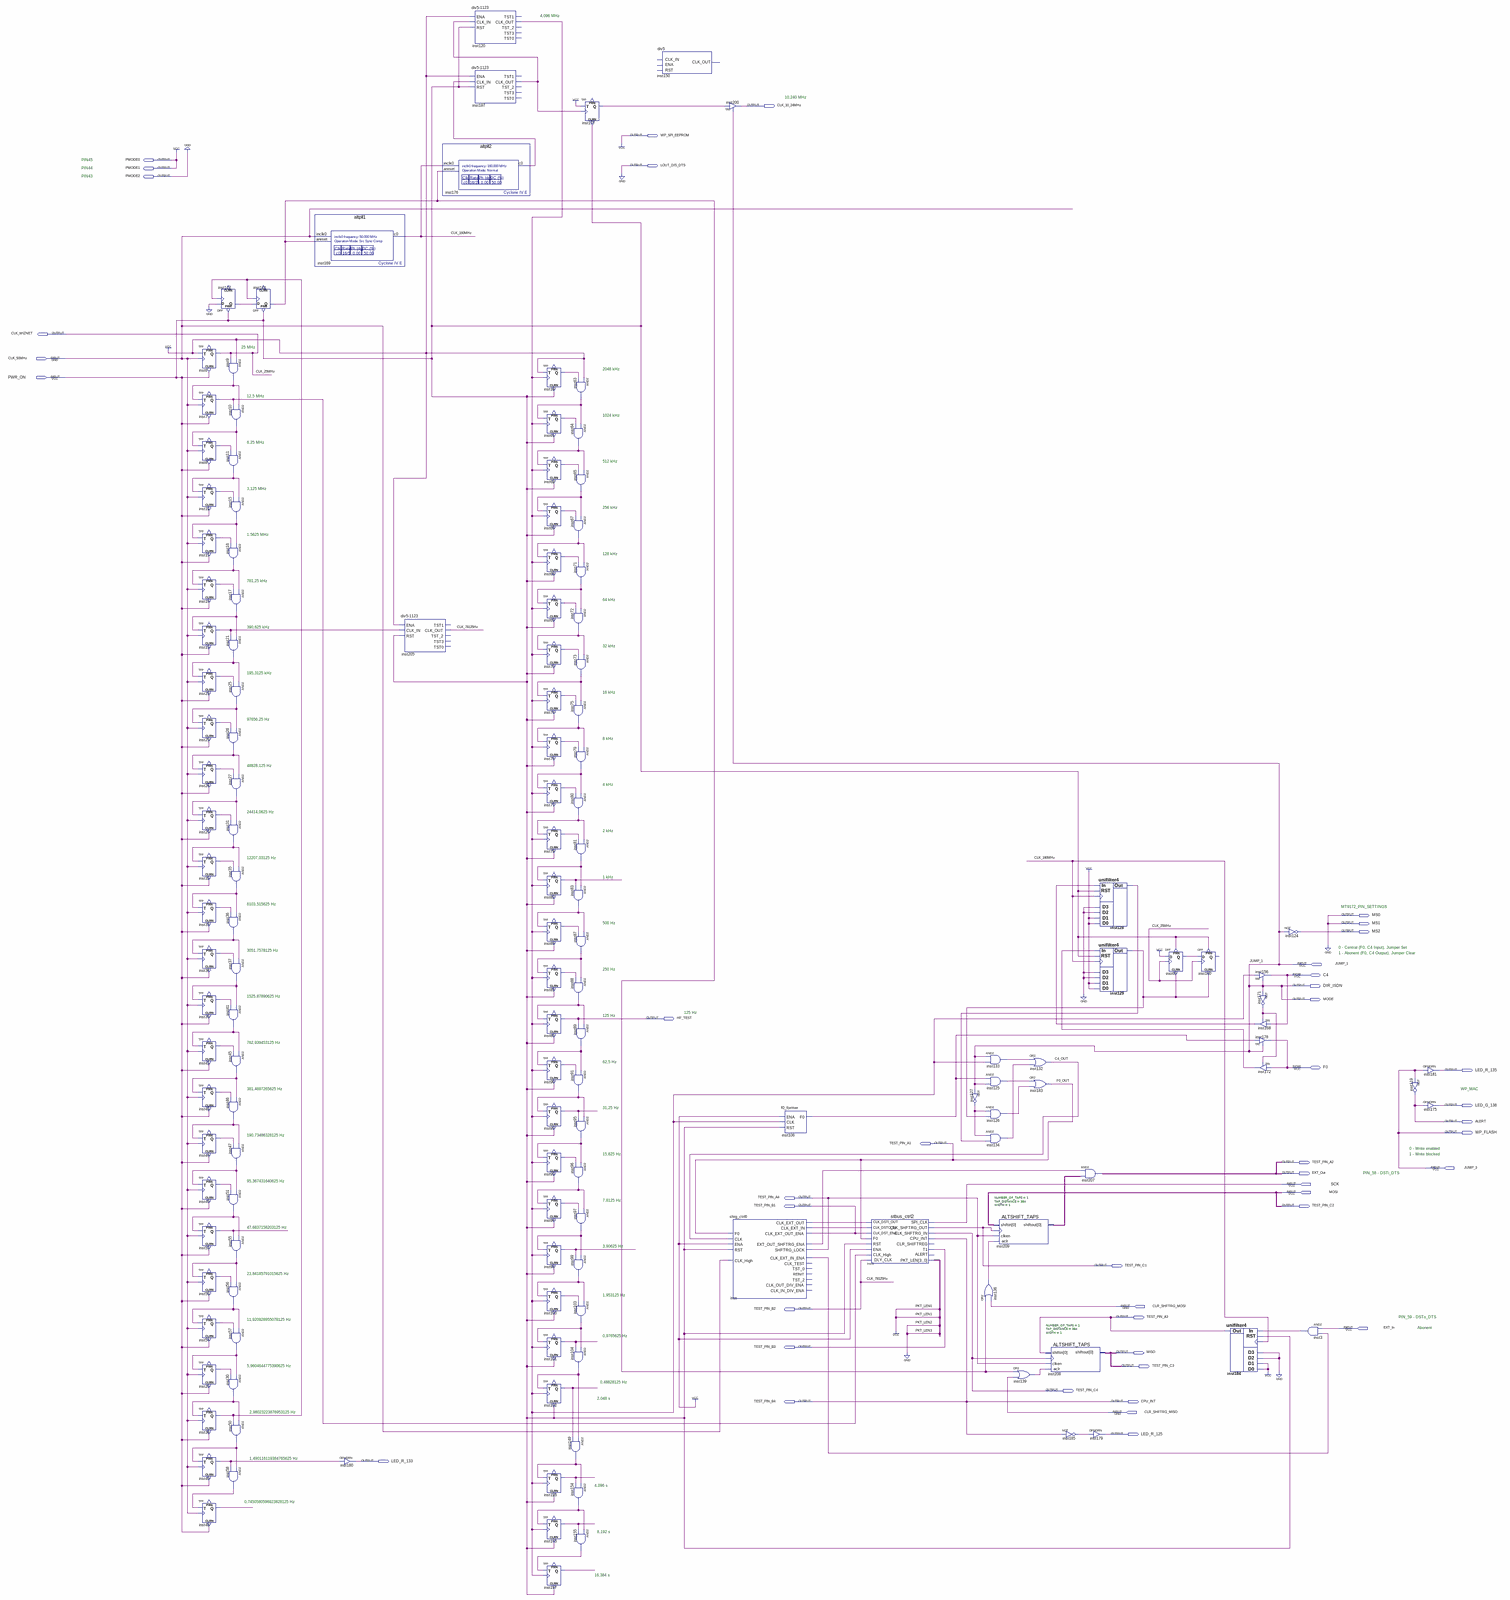
[diagram p0: schematic sheet, whole]
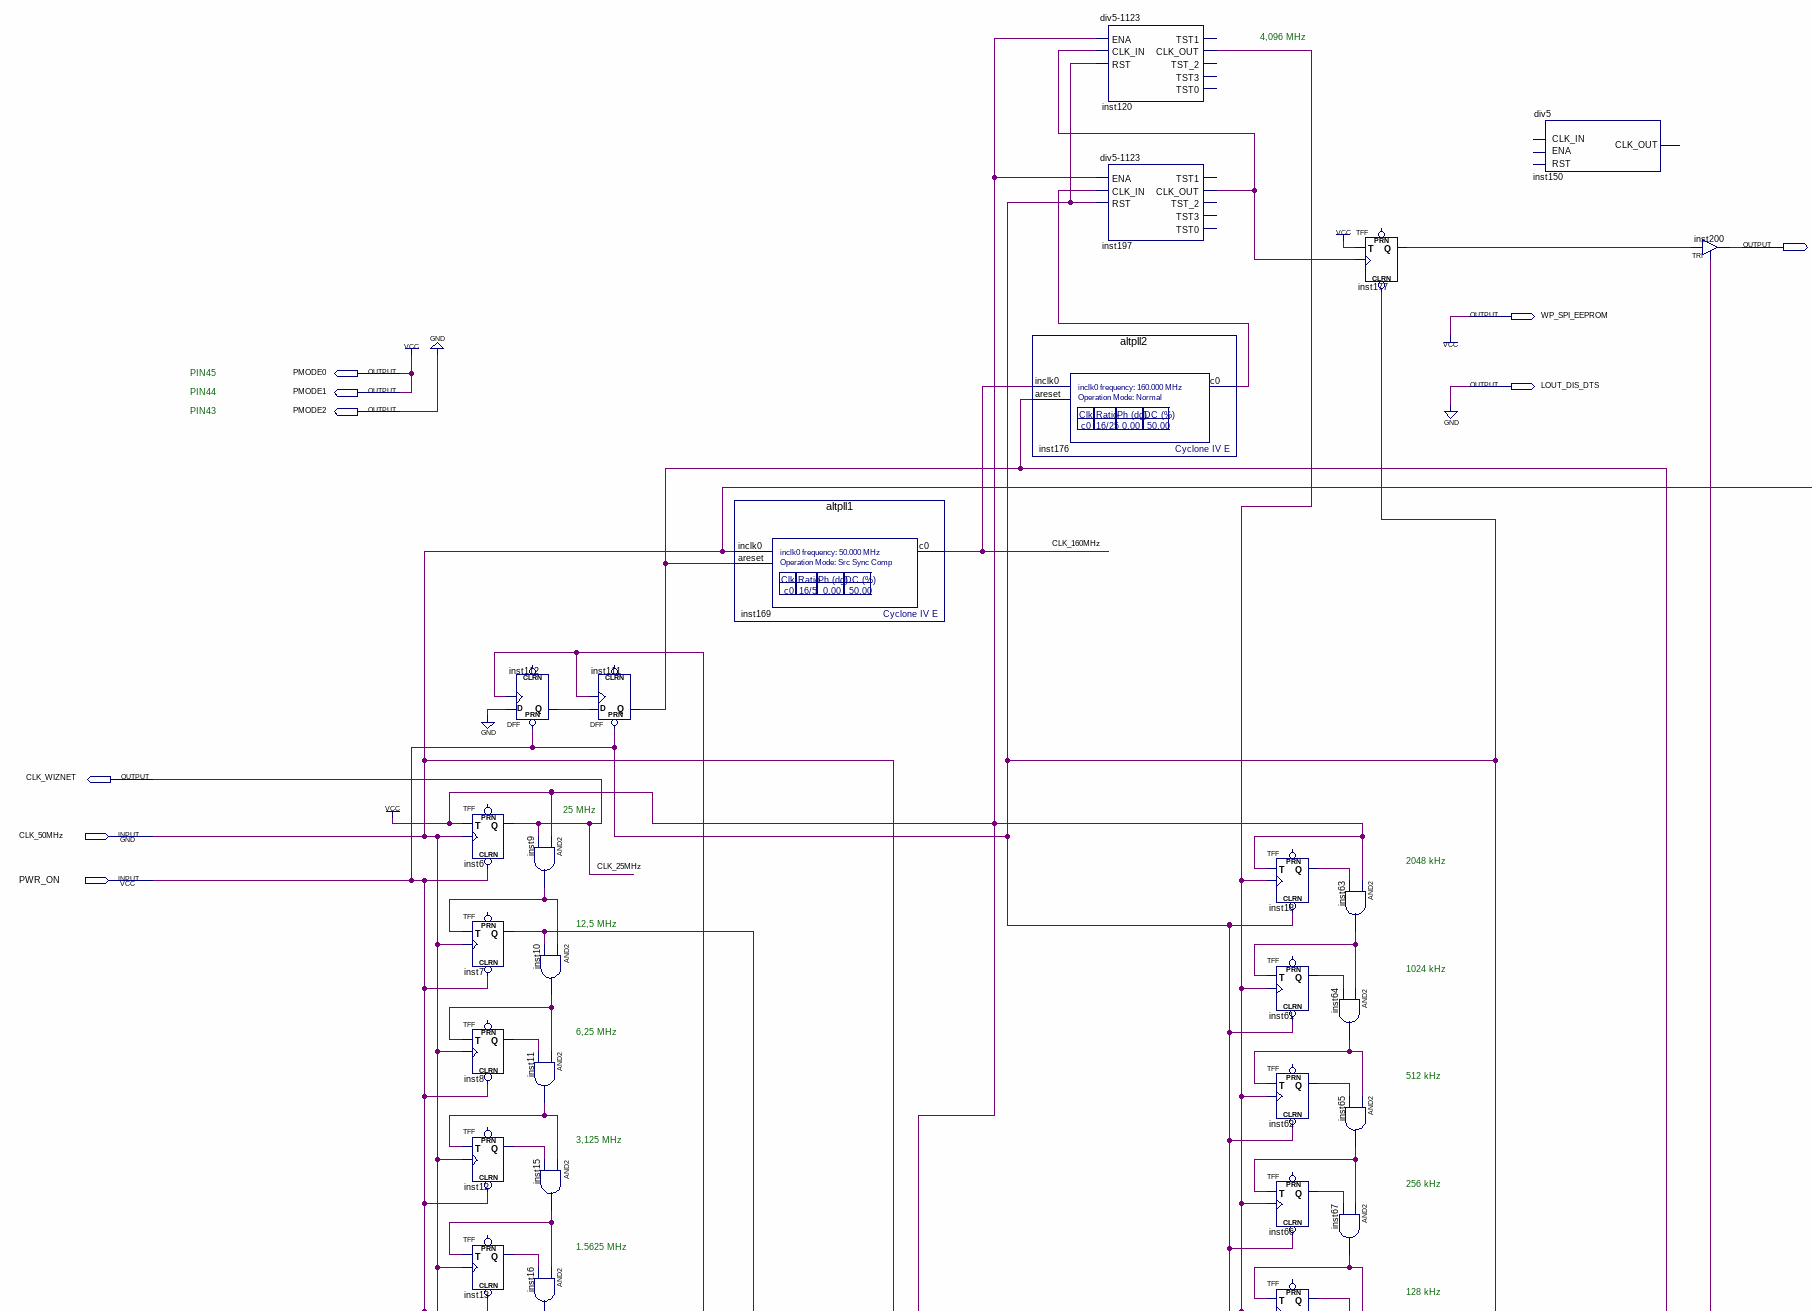
[diagram p1: schematic sheet, upper left part]
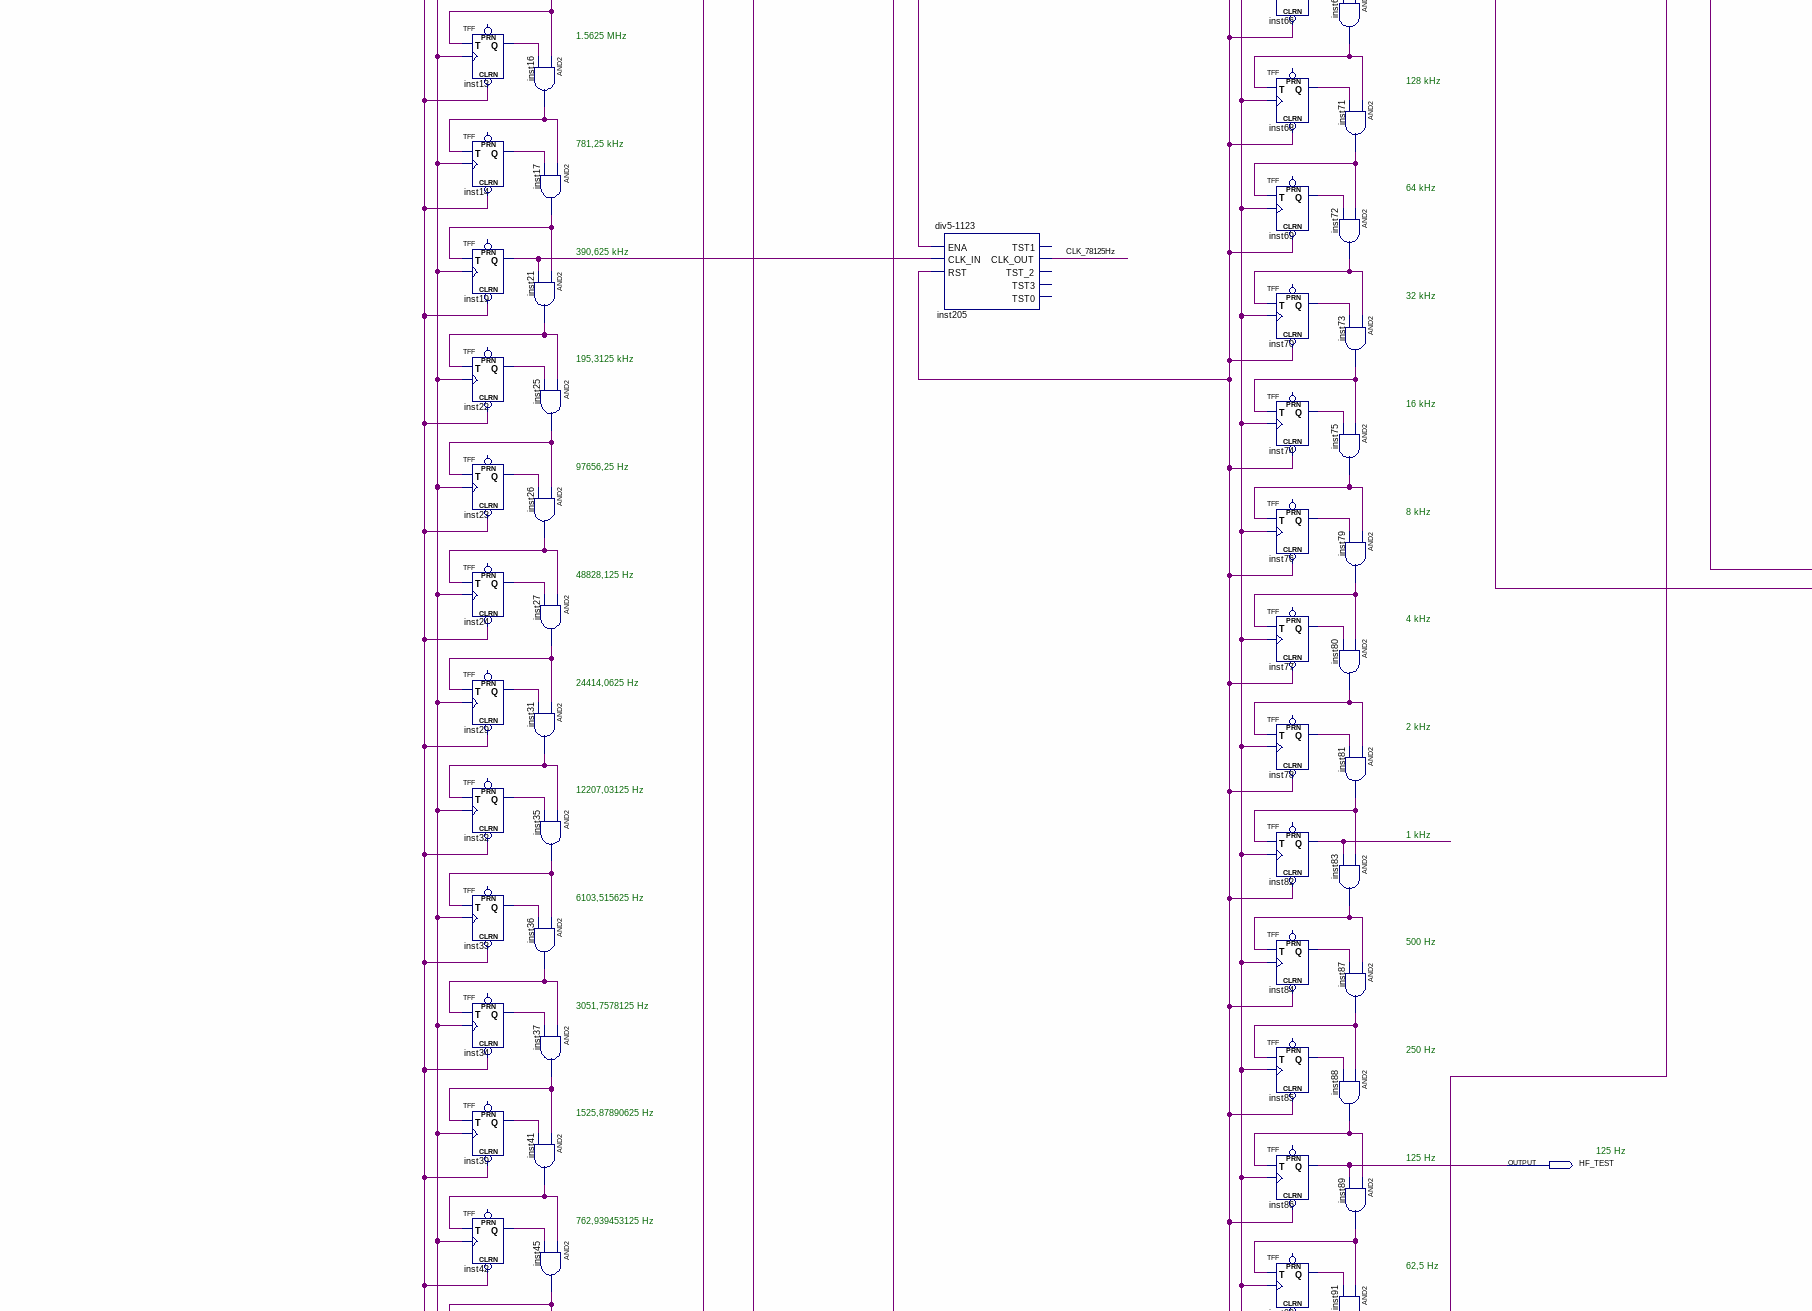
[diagram p2: schematic sheet, middle left part]
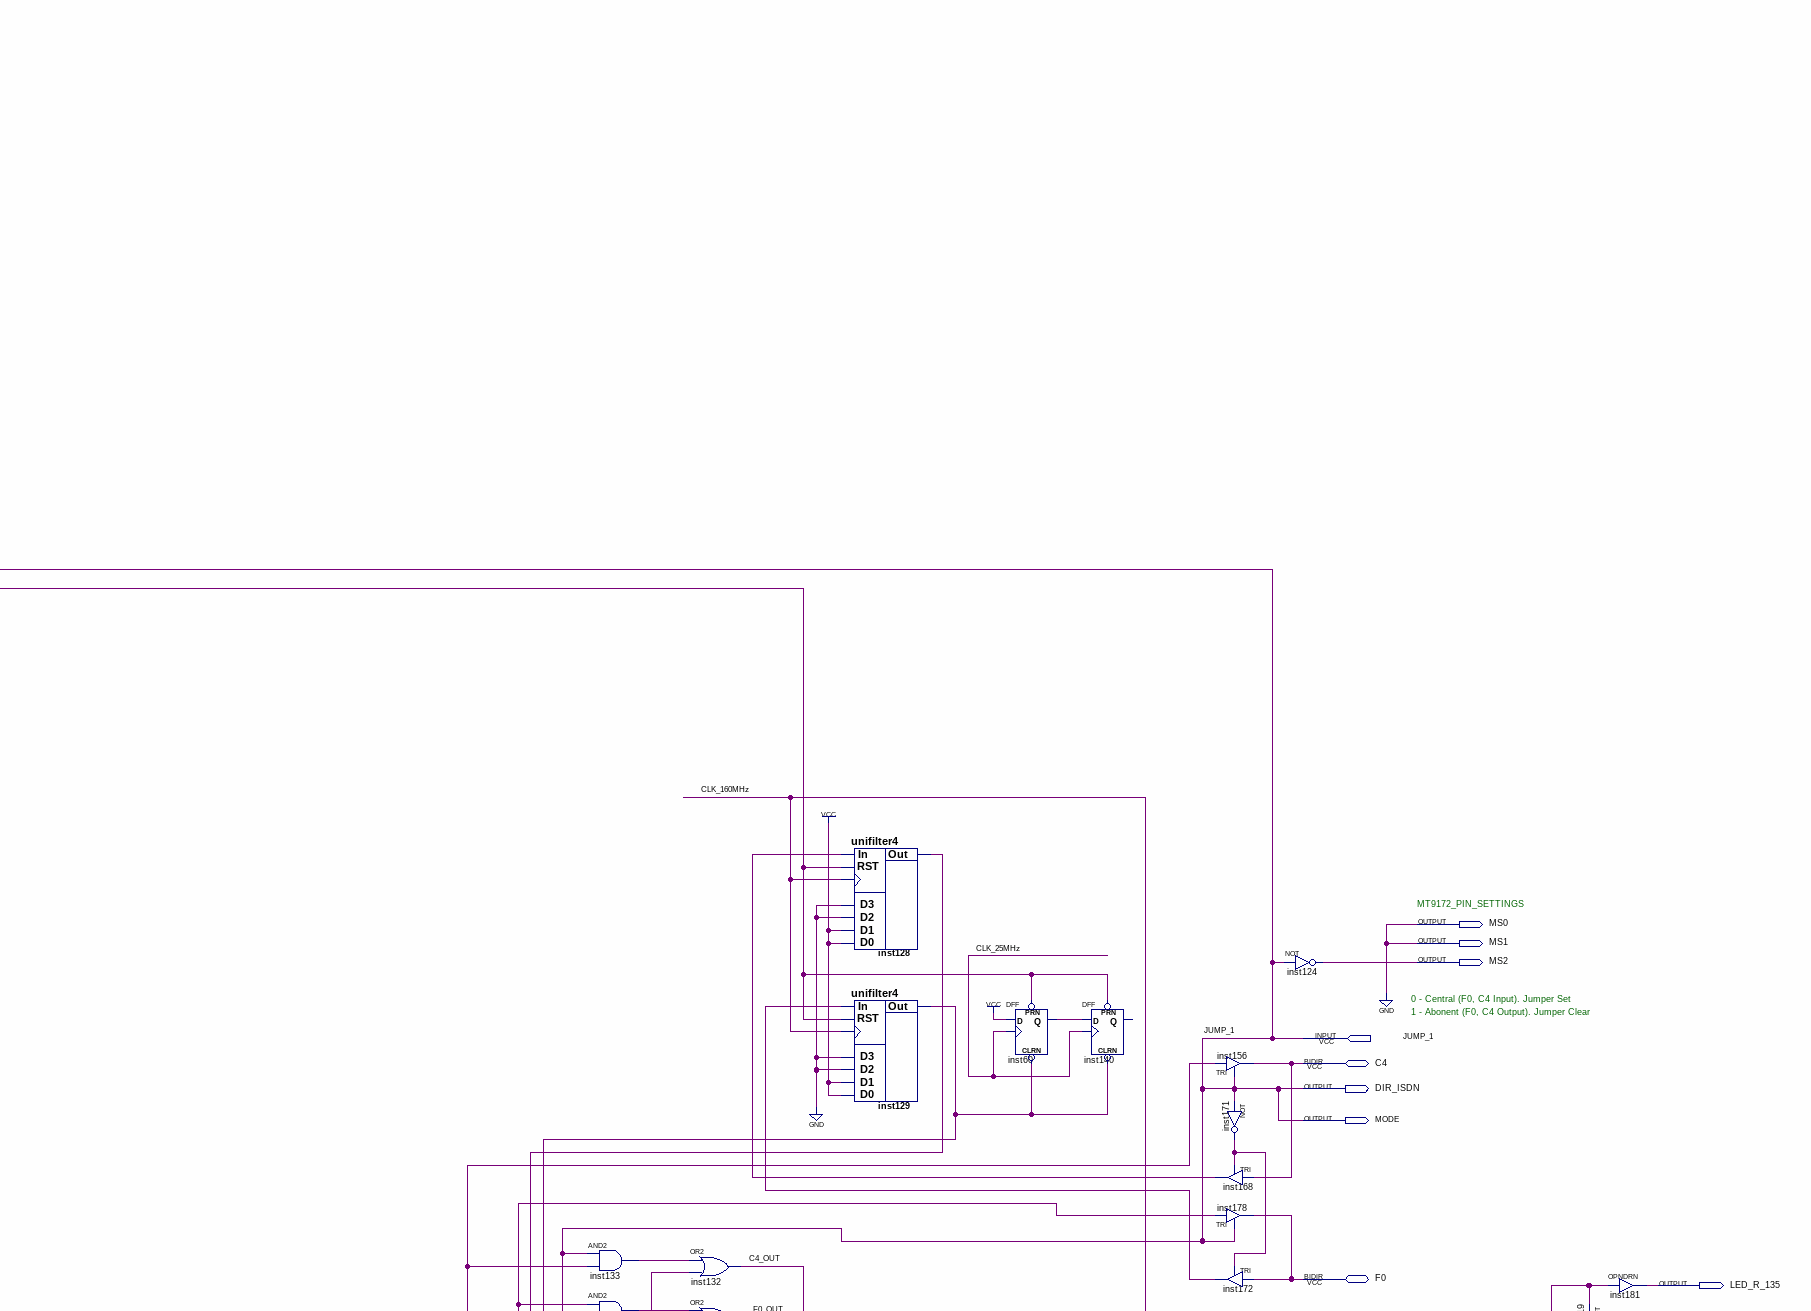
[diagram p3: schematic sheet, middle right part]
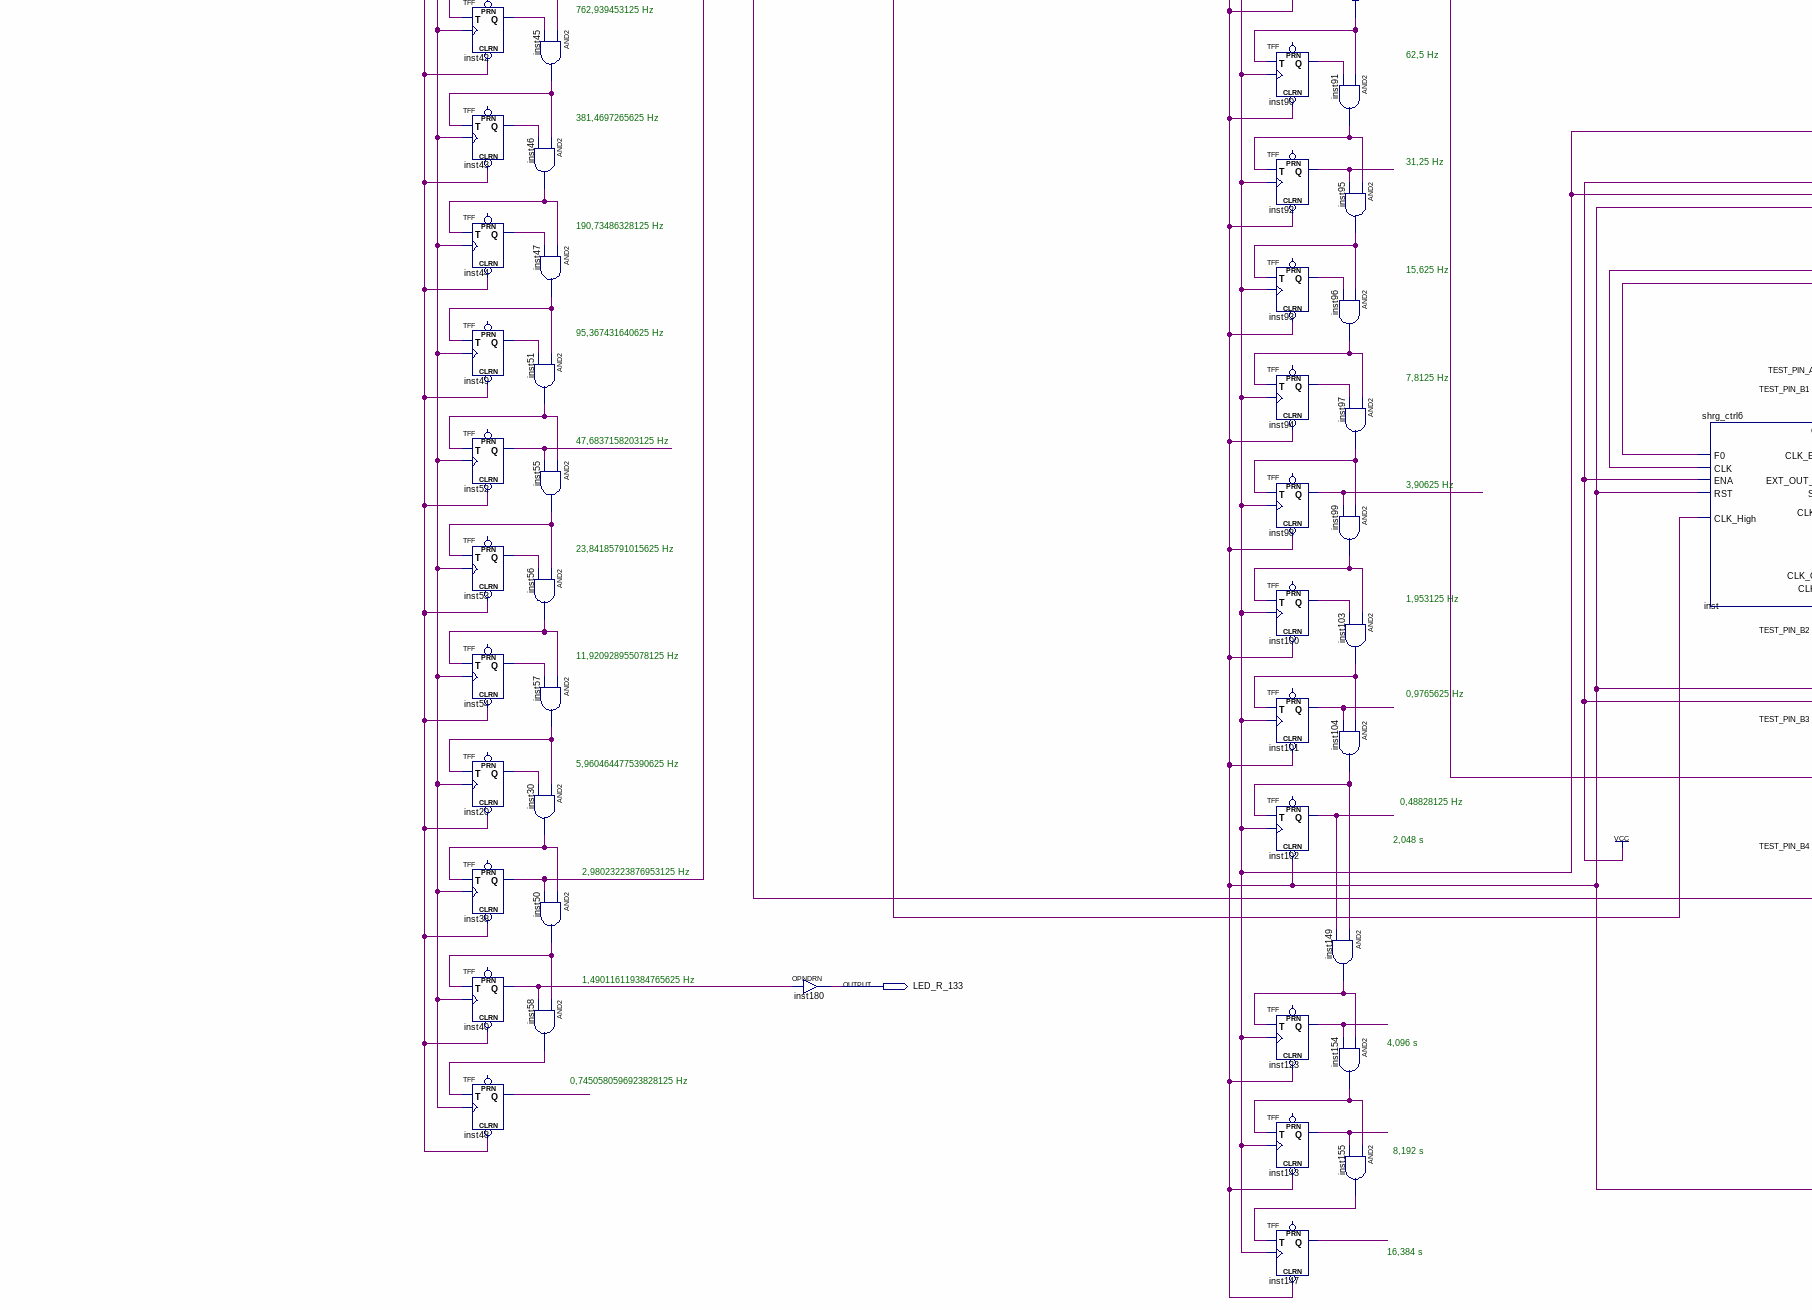
[diagram p4: schematic sheet, lower left part]
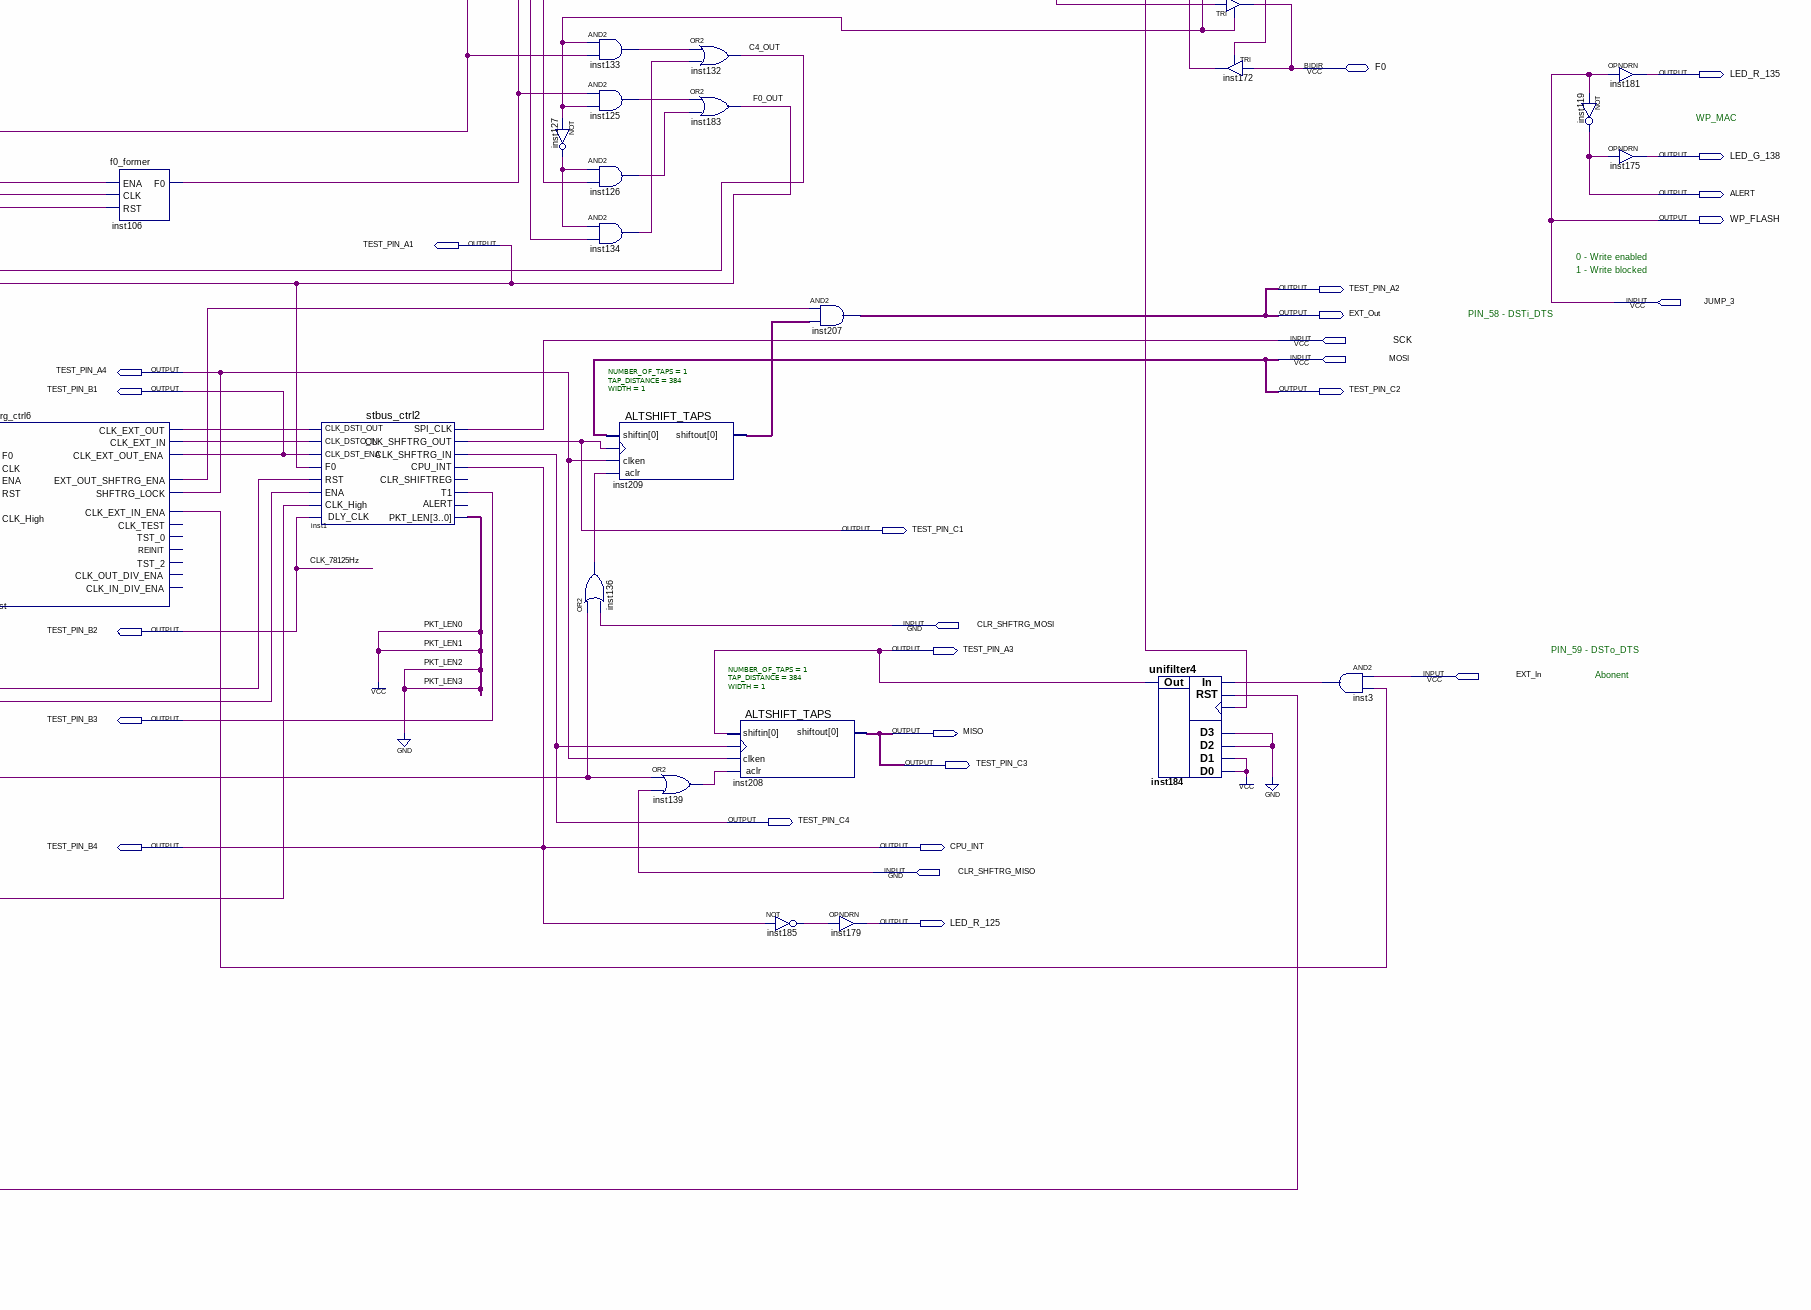
[diagram p5: schematic sheet, lower right part]
// Quartus schematic DCE01_3.bdf as structural Verilog: 145 symbols, 45 pins
module DCE01_3 (
  input  CLK_50MHz,
  input  PWR_ON,
  input  JUMP_1,
  input  JUMP_3,
  input  SCK,
  input  MOSI,
  input  CLR_SHFTRG_MOSI,
  input  EXT_In,
  input  CLR_SHFTRG_MISO,
  inout  C4,
  inout  F0,
  output CLK_10_24MHz,
  output WP_SPI_EEPROM,
  output PMODE0,
  output LOUT_DIS_DTS,
  output PMODE1,
  output PMODE2,
  output CLK_WIZNET,
  output MS0,
  output MS1,
  output MS2,
  output DIR_ISDN,
  output MODE,
  output HF_TEST,
  output LED_R_135,
  output LED_G_138,
  output ALERT,
  output WP_FLASH,
  output TEST_PIN_A1,
  output TEST_PIN_A2,
  output EXT_Out,
  output TEST_PIN_A4,
  output TEST_PIN_B1,
  output TEST_PIN_C2,
  output TEST_PIN_C1,
  output TEST_PIN_B2,
  output TEST_PIN_A3,
  output TEST_PIN_B3,
  output MISO,
  output TEST_PIN_C3,
  output TEST_PIN_C4,
  output TEST_PIN_B4,
  output CPU_INT,
  output LED_R_125,
  output LED_R_133
);

  wire C4_OUT, CLK_160MHz, inst3_out, inst7_q, inst8_q, inst9_out, inst10_out, inst11_out, inst12_q,
       inst13_q, inst14_q, inst15_out, inst16_out, inst17_out, inst18_q, inst19_q, inst20_q, inst21_out,
       inst22_q, inst23_q, inst24_q, inst25_out, inst26_out, inst27_out, inst29_q, inst30_out, inst31_out,
       inst32_q, inst33_q, inst34_q, inst35_out, inst36_out, inst37_out, inst38_q, inst39_q, inst40_q,
       inst41_out, inst42_q, inst43_q, inst44_q, inst45_out, inst46_out, inst47_out, inst48_q, inst49_q,
       inst50_out, inst51_out, inst52_q, inst53_q, inst54_q, inst55_out, inst56_out, inst57_out, inst58_out,
       inst60_q, inst61_q, inst62_q, inst63_out, inst64_out, inst65_out, inst66_q, inst67_out, inst68_q,
       inst69_q, inst70_q, inst71_out, inst72_out, inst73_out, inst74_q, inst75_out, inst76_q, inst77_q,
       inst78_q, inst79_out, inst80_out, inst81_out, inst82_q, inst83_out, inst84_q, inst85_q, inst87_out,
       inst88_out, inst89_out, inst90_q, inst91_out, inst92_q, inst93_q, inst94_q, inst95_out, inst96_out,
       inst97_out, inst98_q, inst99_out, inst100_q, inst101_q, inst102_q, inst103_out, inst104_out,
       inst106_f0, inst111_q, inst112_q, inst120_clk_out, inst123_q, inst125_out, inst126_out, inst127_out,
       inst128_out, inst129_out, inst133_out, inst134_out, inst136_out, inst139_out, inst143_q, inst147_q,
       inst149_out, inst154_out, inst155_out, inst168_out, inst171_out, inst172_out, inst176_c0, inst177_q,
       inst185_out, inst197_clk_out, inst209_shiftout, inst_clk_ext_in, inst_clk_ext_in_ena,
       inst_clk_ext_out, inst_ext_out_shftrg_ena;

  TFF inst6 (.CLRN(PWR_ON), .T(1'b1), .CLK(CLK_50MHz), .Q(CLK_WIZNET));  // open: PRN
  TFF inst7 (.CLRN(PWR_ON), .T(inst9_out), .CLK(CLK_50MHz), .Q(inst7_q));  // open: PRN
  TFF inst8 (.CLRN(PWR_ON), .T(inst10_out), .CLK(CLK_50MHz), .Q(inst8_q));  // open: PRN
  TFF inst12 (.CLRN(PWR_ON), .T(inst11_out), .CLK(CLK_50MHz), .Q(inst12_q));  // open: PRN
  TFF inst13 (.CLRN(PWR_ON), .T(inst15_out), .CLK(CLK_50MHz), .Q(inst13_q));  // open: PRN
  TFF inst14 (.CLRN(PWR_ON), .T(inst16_out), .CLK(CLK_50MHz), .Q(inst14_q));  // open: PRN
  TFF inst19 (.CLRN(PWR_ON), .T(inst17_out), .CLK(CLK_50MHz), .Q(inst19_q));  // open: PRN
  TFF inst22 (.CLRN(PWR_ON), .T(inst21_out), .CLK(CLK_50MHz), .Q(inst22_q));  // open: PRN
  TFF inst23 (.CLRN(PWR_ON), .T(inst25_out), .CLK(CLK_50MHz), .Q(inst23_q));  // open: PRN
  TFF inst24 (.CLRN(PWR_ON), .T(inst26_out), .CLK(CLK_50MHz), .Q(inst24_q));  // open: PRN
  TFF inst29 (.CLRN(PWR_ON), .T(inst27_out), .CLK(CLK_50MHz), .Q(inst29_q));  // open: PRN
  TFF inst32 (.CLRN(PWR_ON), .T(inst31_out), .CLK(CLK_50MHz), .Q(inst32_q));  // open: PRN
  TFF inst33 (.CLRN(PWR_ON), .T(inst35_out), .CLK(CLK_50MHz), .Q(inst33_q));  // open: PRN
  TFF inst34 (.CLRN(PWR_ON), .T(inst36_out), .CLK(CLK_50MHz), .Q(inst34_q));  // open: PRN
  TFF inst39 (.CLRN(PWR_ON), .T(inst37_out), .CLK(CLK_50MHz), .Q(inst39_q));  // open: PRN
  TFF inst42 (.CLRN(PWR_ON), .T(inst41_out), .CLK(CLK_50MHz), .Q(inst42_q));  // open: PRN
  TFF inst43 (.CLRN(PWR_ON), .T(inst45_out), .CLK(CLK_50MHz), .Q(inst43_q));  // open: PRN
  TFF inst44 (.CLRN(PWR_ON), .T(inst46_out), .CLK(CLK_50MHz), .Q(inst44_q));  // open: PRN
  TFF inst49 (.CLRN(PWR_ON), .T(inst47_out), .CLK(CLK_50MHz), .Q(inst49_q));  // open: PRN
  TFF inst52 (.CLRN(PWR_ON), .T(inst51_out), .CLK(CLK_50MHz), .Q(inst52_q));  // open: PRN
  TFF inst53 (.CLRN(PWR_ON), .T(inst55_out), .CLK(CLK_50MHz), .Q(inst53_q));  // open: PRN
  TFF inst54 (.CLRN(PWR_ON), .T(inst56_out), .CLK(CLK_50MHz), .Q(inst54_q));  // open: PRN
  TFF inst20 (.CLRN(PWR_ON), .T(inst57_out), .CLK(CLK_50MHz), .Q(inst20_q));  // open: PRN
  TFF inst38 (.CLRN(PWR_ON), .T(inst30_out), .CLK(CLK_50MHz), .Q(inst38_q));  // open: PRN
  TFF inst40 (.CLRN(PWR_ON), .T(inst50_out), .CLK(CLK_50MHz), .Q(inst40_q));  // open: PRN
  TFF inst48 (.CLRN(PWR_ON), .T(inst58_out), .CLK(CLK_50MHz), .Q(inst48_q));  // open: PRN
  DFF inst112 (.CLK(inst38_q), .D(1'b0), .PRN(PWR_ON), .Q(inst112_q));  // open: CLRN
  and inst9 (inst9_out, 1'b1, CLK_WIZNET);
  and inst10 (inst10_out, inst9_out, inst7_q);
  and inst11 (inst11_out, inst10_out, inst8_q);
  and inst15 (inst15_out, inst11_out, inst12_q);
  and inst16 (inst16_out, inst15_out, inst13_q);
  and inst17 (inst17_out, inst16_out, inst14_q);
  and inst21 (inst21_out, inst17_out, inst19_q);
  and inst25 (inst25_out, inst21_out, inst22_q);
  and inst26 (inst26_out, inst25_out, inst23_q);
  and inst27 (inst27_out, inst26_out, inst24_q);
  and inst31 (inst31_out, inst27_out, inst29_q);
  and inst35 (inst35_out, inst31_out, inst32_q);
  and inst36 (inst36_out, inst35_out, inst33_q);
  and inst37 (inst37_out, inst36_out, inst34_q);
  and inst41 (inst41_out, inst37_out, inst39_q);
  and inst45 (inst45_out, inst41_out, inst42_q);
  and inst46 (inst46_out, inst45_out, inst43_q);
  and inst47 (inst47_out, inst46_out, inst44_q);
  and inst51 (inst51_out, inst47_out, inst49_q);
  and inst55 (inst55_out, inst51_out, inst52_q);
  and inst56 (inst56_out, inst55_out, inst53_q);
  and inst57 (inst57_out, inst56_out, inst54_q);
  and inst30 (inst30_out, inst57_out, inst20_q);
  and inst50 (inst50_out, inst30_out, inst38_q);
  and inst58 (inst58_out, inst50_out, inst40_q);
  DFF inst111 (.CLK(inst38_q), .D(inst112_q), .PRN(PWR_ON), .Q(inst111_q));  // open: CLRN
  altpll1 inst169 (.inclk0(CLK_50MHz), .areset(inst111_q), .c0(CLK_160MHz));
  OPNDRN inst180 (.IN(inst40_q), .OUT(LED_R_133));
  \div5-1123  inst205 (
    .ENA(1'b1), .CLK_IN(inst19_q), .RST(PWR_ON), .CLK_OUT(TEST_PIN_B2));  // open: TST1, TST_2, TST3, TST0
  altpll2 inst176 (.inclk0(CLK_160MHz), .areset(inst111_q), .c0(inst176_c0));
  \div5-1123  inst120 (
    .ENA(1'b1), .CLK_IN(inst197_clk_out), .RST(PWR_ON), .CLK_OUT(inst120_clk_out));  // open: TST1, TST_2, TST3, TST0
  \div5-1123  inst197 (
    .ENA(1'b1), .CLK_IN(inst176_c0), .RST(PWR_ON), .CLK_OUT(inst197_clk_out));  // open: TST1, TST_2, TST3, TST0
  TFF inst18 (.CLRN(PWR_ON), .T(1'b1), .CLK(inst120_clk_out), .Q(inst18_q));  // open: PRN
  TFF inst61 (.CLRN(PWR_ON), .T(inst63_out), .CLK(inst120_clk_out), .Q(inst61_q));  // open: PRN
  TFF inst62 (.CLRN(PWR_ON), .T(inst64_out), .CLK(inst120_clk_out), .Q(inst62_q));  // open: PRN
  TFF inst66 (.CLRN(PWR_ON), .T(inst65_out), .CLK(inst120_clk_out), .Q(inst66_q));  // open: PRN
  TFF inst68 (.CLRN(PWR_ON), .T(inst67_out), .CLK(inst120_clk_out), .Q(inst68_q));  // open: PRN
  TFF inst69 (.CLRN(PWR_ON), .T(inst71_out), .CLK(inst120_clk_out), .Q(inst69_q));  // open: PRN
  TFF inst70 (.CLRN(PWR_ON), .T(inst72_out), .CLK(inst120_clk_out), .Q(inst70_q));  // open: PRN
  TFF inst74 (.CLRN(PWR_ON), .T(inst73_out), .CLK(inst120_clk_out), .Q(inst74_q));  // open: PRN
  TFF inst76 (.CLRN(PWR_ON), .T(inst75_out), .CLK(inst120_clk_out), .Q(inst76_q));  // open: PRN
  TFF inst77 (.CLRN(PWR_ON), .T(inst79_out), .CLK(inst120_clk_out), .Q(inst77_q));  // open: PRN
  TFF inst78 (.CLRN(PWR_ON), .T(inst80_out), .CLK(inst120_clk_out), .Q(inst78_q));  // open: PRN
  TFF inst82 (.CLRN(PWR_ON), .T(inst81_out), .CLK(inst120_clk_out), .Q(inst82_q));  // open: PRN
  TFF inst84 (.CLRN(PWR_ON), .T(inst83_out), .CLK(inst120_clk_out), .Q(inst84_q));  // open: PRN
  TFF inst85 (.CLRN(PWR_ON), .T(inst87_out), .CLK(inst120_clk_out), .Q(inst85_q));  // open: PRN
  TFF inst86 (.CLRN(PWR_ON), .T(inst88_out), .CLK(inst120_clk_out), .Q(HF_TEST));  // open: PRN
  TFF inst90 (.CLRN(PWR_ON), .T(inst89_out), .CLK(inst120_clk_out), .Q(inst90_q));  // open: PRN
  TFF inst92 (.CLRN(PWR_ON), .T(inst91_out), .CLK(inst120_clk_out), .Q(inst92_q));  // open: PRN
  TFF inst93 (.CLRN(PWR_ON), .T(inst95_out), .CLK(inst120_clk_out), .Q(inst93_q));  // open: PRN
  TFF inst94 (.CLRN(PWR_ON), .T(inst96_out), .CLK(inst120_clk_out), .Q(inst94_q));  // open: PRN
  TFF inst98 (.CLRN(PWR_ON), .T(inst97_out), .CLK(inst120_clk_out), .Q(inst98_q));  // open: PRN
  TFF inst100 (.CLRN(PWR_ON), .T(inst99_out), .CLK(inst120_clk_out), .Q(inst100_q));  // open: PRN
  TFF inst101 (.CLRN(PWR_ON), .T(inst103_out), .CLK(inst120_clk_out), .Q(inst101_q));  // open: PRN
  TFF inst102 (.CLRN(PWR_ON), .T(inst104_out), .CLK(inst120_clk_out), .Q(inst102_q));  // open: PRN
  TFF inst123 (.CLRN(PWR_ON), .T(inst149_out), .CLK(inst120_clk_out), .Q(inst123_q));  // open: PRN
  TFF inst143 (.CLRN(PWR_ON), .T(inst154_out), .CLK(inst120_clk_out), .Q(inst143_q));  // open: PRN
  TFF inst147 (.CLRN(PWR_ON), .T(inst155_out), .CLK(inst120_clk_out), .Q(inst147_q));  // open: PRN
  and inst149 (inst149_out, inst104_out, inst102_q);
  TFF inst177 (.CLRN(PWR_ON), .T(1'b1), .CLK(inst197_clk_out), .Q(inst177_q));  // open: PRN
  and inst63 (inst63_out, 1'b1, inst18_q);
  and inst64 (inst64_out, inst63_out, inst61_q);
  and inst65 (inst65_out, inst64_out, inst62_q);
  and inst67 (inst67_out, inst65_out, inst66_q);
  and inst71 (inst71_out, inst67_out, inst68_q);
  and inst72 (inst72_out, inst71_out, inst69_q);
  and inst73 (inst73_out, inst72_out, inst70_q);
  and inst75 (inst75_out, inst73_out, inst74_q);
  and inst79 (inst79_out, inst75_out, inst76_q);
  and inst80 (inst80_out, inst79_out, inst77_q);
  and inst81 (inst81_out, inst80_out, inst78_q);
  and inst83 (inst83_out, inst81_out, inst82_q);
  and inst87 (inst87_out, inst83_out, inst84_q);
  and inst88 (inst88_out, inst87_out, inst85_q);
  and inst89 (inst89_out, inst88_out, HF_TEST);
  and inst91 (inst91_out, inst89_out, inst90_q);
  and inst95 (inst95_out, inst91_out, inst92_q);
  and inst96 (inst96_out, inst95_out, inst93_q);
  and inst97 (inst97_out, inst96_out, inst94_q);
  and inst99 (inst99_out, inst97_out, inst98_q);
  and inst103 (inst103_out, inst99_out, inst100_q);
  and inst104 (inst104_out, inst103_out, inst101_q);
  and inst154 (inst154_out, inst149_out, inst123_q);
  and inst155 (inst155_out, inst154_out, inst143_q);
  div5 inst150 ();  // open: CLK_IN, ENA, RST, CLK_OUT
  TRI inst200 (.IN(inst177_q), .OE(JUMP_1), .OUT(CLK_10_24MHz));
  shrg_ctrl6 inst (
    .CLK(C4_OUT), .CLK_High(CLK_50MHz), .ENA(1'b1), .F0(TEST_PIN_A1), .RST(PWR_ON),
    .CLK_EXT_IN(inst_clk_ext_in), .CLK_EXT_IN_ENA(inst_clk_ext_in_ena), .CLK_EXT_OUT(inst_clk_ext_out),
    .CLK_EXT_OUT_ENA(TEST_PIN_B1), .EXT_OUT_SHFTRG_ENA(inst_ext_out_shftrg_ena), .SHFTRG_LOCK(TEST_PIN_A4));  // open: CLK_IN_DIV_ENA, CLK_OUT_DIV_ENA, CLK_TEST, REINIT, TST_0, TST_2
  f0_former inst106 (.ENA(1'b1), .CLK(inst120_clk_out), .RST(PWR_ON), .F0(inst106_f0));
  stbus_ctrl2 inst1 (
    .CLK_DSTI_OUT(inst_clk_ext_out), .CLK_DSTO_IN(inst_clk_ext_in), .CLK_DST_ENA(TEST_PIN_B1),
    .F0(TEST_PIN_A1), .RST(PWR_ON), .ENA(1'b1), .SPI_CLK(SCK), .CLK_High(inst7_q), .PKT_LEN(4'b0011),
    .DLY_CLK(TEST_PIN_B2), .CLK_SHFTRG_OUT(TEST_PIN_C1), .CLK_SHFTRG_IN(TEST_PIN_C4), .CPU_INT(CPU_INT),
    .T1(TEST_PIN_B3));  // open: CLR_SHIFTREG, ALERT
  not inst127 (inst127_out, JUMP_1);
  or inst136 (inst136_out, inst111_q, CLR_SHFTRG_MOSI);
  and inst133 (inst133_out, JUMP_1, inst120_clk_out);
  and inst125 (inst125_out, inst106_f0, JUMP_1);
  and inst126 (inst126_out, inst127_out, inst129_out);
  and inst134 (inst134_out, inst127_out, inst128_out);
  ALTSHIFT_TAPS #(.NUMBER_OF_TAPS(1), .TAP_DISTANCE(384), .WIDTH(1)) inst209 (
    .aclr(inst136_out), .clken(TEST_PIN_A4), .clock(TEST_PIN_C1), .shiftin(MOSI), .shiftout(inst209_shiftout));
  or inst139 (inst139_out, inst111_q, CLR_SHFTRG_MISO);
  or inst132 (C4_OUT, inst133_out, inst134_out);
  or inst183 (TEST_PIN_A1, inst125_out, inst126_out);
  ALTSHIFT_TAPS #(.NUMBER_OF_TAPS(1), .TAP_DISTANCE(384), .WIDTH(1)) inst208 (
    .aclr(inst139_out), .clken(TEST_PIN_A4), .clock(TEST_PIN_C4), .shiftin(TEST_PIN_A3), .shiftout(MISO));
  not inst185 (inst185_out, CPU_INT);
  and inst207 (EXT_Out, inst_ext_out_shftrg_ena, inst209_shiftout);
  OPNDRN inst179 (.IN(inst185_out), .OUT(LED_R_125));
  unifilter4 inst128 (
    .RST(PWR_ON), .In(inst168_out), .D3(1'b0), .D2(1'b0), .D1(1'b1), .D0(1'b1), .CLK(CLK_160MHz),
    .Out(inst128_out));
  unifilter4 inst129 (
    .RST(PWR_ON), .In(inst172_out), .D3(1'b0), .D2(1'b0), .D1(1'b1), .D0(1'b1), .CLK(CLK_160MHz),
    .Out(inst129_out));
  DFF inst60 (.CLRN(inst129_out), .CLK(CLK_WIZNET), .D(1'b1), .PRN(PWR_ON), .Q(inst60_q));
  DFF inst140 (.CLRN(inst129_out), .CLK(CLK_WIZNET), .D(inst60_q), .PRN(PWR_ON));  // open: Q
  unifilter4 inst184 (
    .RST(PWR_ON), .In(inst3_out), .D3(1'b0), .D2(1'b0), .D1(1'b1), .D0(1'b1), .CLK(CLK_160MHz),
    .Out(TEST_PIN_A3));
  TRI inst156 (.IN(inst120_clk_out), .OE(JUMP_1), .OUT(C4));
  not inst171 (inst171_out, JUMP_1);
  TRI inst168 (.IN(C4), .OE(inst171_out), .OUT(inst168_out));
  TRI inst178 (.IN(inst106_f0), .OE(JUMP_1), .OUT(F0));
  TRI inst172 (.IN(F0), .OE(inst171_out), .OUT(inst172_out));
  not inst124 (MS2, JUMP_1);
  and inst3 (inst3_out, EXT_In, inst_clk_ext_in_ena);
  not inst119 (ALERT, JUMP_3);
  OPNDRN inst181 (.IN(JUMP_3), .OUT(LED_R_135));
  OPNDRN inst175 (.IN(ALERT), .OUT(LED_G_138));

  assign DIR_ISDN = JUMP_1;
  assign LOUT_DIS_DTS = 1'b0;
  assign MODE = JUMP_1;
  assign MS0 = 1'b0;
  assign MS1 = 1'b0;
  assign PMODE0 = 1'b1;
  assign PMODE1 = 1'b1;
  assign PMODE2 = 1'b0;
  assign TEST_PIN_A2 = EXT_Out;
  assign TEST_PIN_B4 = CPU_INT;
  assign TEST_PIN_C2 = MOSI;
  assign TEST_PIN_C3 = MISO;
  assign WP_FLASH = JUMP_3;
  assign WP_SPI_EEPROM = 1'b1;

  // Other names for the same wires on the sheet: CLK_25MHz = CLK_WIZNET; CLK_78125Hz = TEST_PIN_B2;
  //   F0_OUT = TEST_PIN_A1

  // Notes on the sheet:
  //   4,096 MHz
  //   10,240 MHz
  //   PIN45
  //   PIN44
  //   PIN43
  //   25 MHz
  //   2048 kHz
  //   12,5 MHz
  //   1024 kHz
  //   6,25 MHz
  //   512 kHz
  //   3,125 MHz
  //   256 kHz
  //   1.5625 MHz
  //   128 kHz
  //   781,25 kHz
  //   64 kHz
  //   390,625 kHz
  //   32 kHz
  //   195,3125 kHz
  //   16 kHz
  //   97656,25 Hz
  //   8 kHz
  //   48828,125 Hz
  //   4 kHz
  //   24414,0625 Hz
  //   2 kHz
  //   12207,03125 Hz
  //   1 kHz
  //   6103,515625 Hz
  //   MT9172_PIN_SETTINGS
  //   500 Hz
  //   0 - Central (F0, C4 Input). Jumper Set
  //   3051,7578125 Hz
  //   1 - Abonent (F0, C4 Output). Jumper Clear
  //   250 Hz
  //   1525,87890625 Hz
  //   125 Hz
  //   125 Hz
  //   762,939453125 Hz
  //   62,5 Hz
  //   381,4697265625 Hz
  //   WP_MAC
  //   31,25 Hz
  //   190,73486328125 Hz
  //   0 - Write enabled
  //   15,625 Hz
  //   1 - Write blocked
  //   PIN_58 - DSTi_DTS
  //   95,367431640625 Hz
  //   7,8125 Hz
  //   47,6837158203125 Hz
  //   3,90625 Hz
  //   23,84185791015625 Hz
  //   1,953125 Hz
  //   PIN_59 - DSTo_DTS
  //   11,920928955078125 Hz
  //   Abonent
  //   0,9765625 Hz
  //   5,9604644775390625 Hz
  //   0,48828125 Hz
  //   2,048 s
  //   2,98023223876953125 Hz
  //   1,490116119384765625 Hz
  //   4,096 s
  //   0,7450580596923828125 Hz
  //   8,192 s
  //   16,384 s
endmodule
